# Altium schematic sheet XbeeB.SchDoc
size A4; SheetNumber: 2; SheetTotal: 3
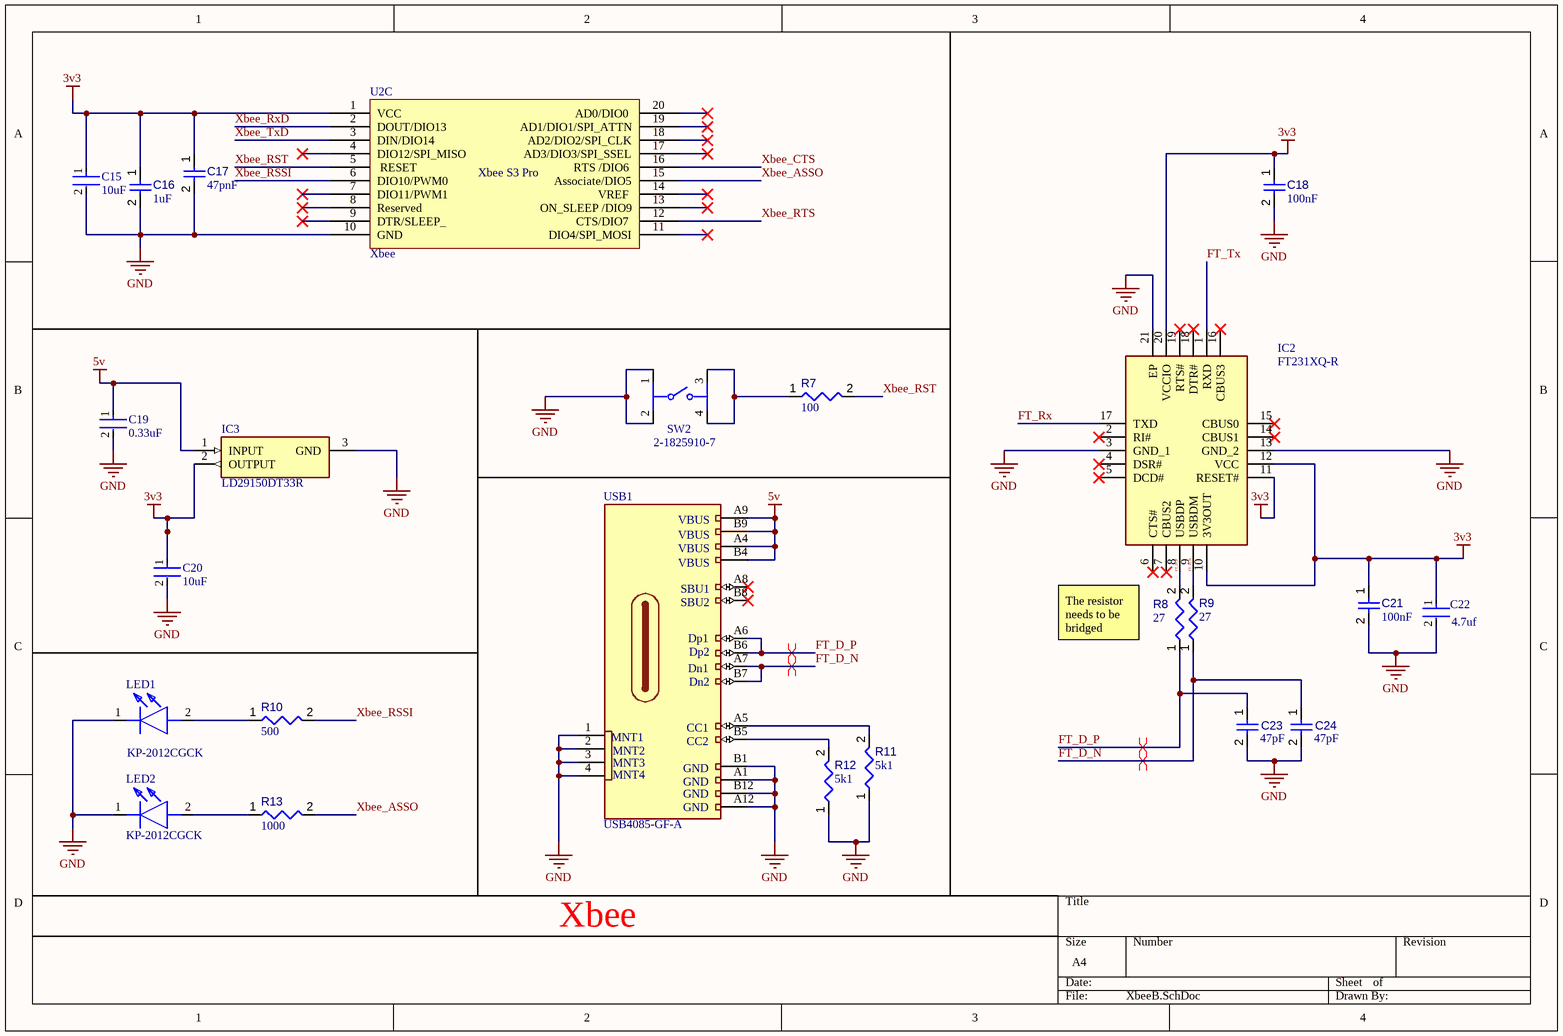
[diagram p0: XbeeB.SchDoc]

## Parts
C15  10uF  [FP-CC1210-GA-MFG]
C16  value 1uF  [CAPC1608X90X40NL10T20]  (hidden comment: Capacitor 100 nF +/-10% 50 V 0603)
C17  value 47pnF  [CAPC1608X90X40NL10T20]  (hidden comment: Capacitor 100 nF +/-10% 50 V 0603)
C18  value 100nF  [CAPC1608X90X40NL10T20]  (hidden comment: Capacitor 100 nF +/-10% 50 V 0603)
C19  0.33uF  [FP-CC1210-GA-MFG]
C20  10uF  [FP-CC1210-GA-MFG]
C21  value 100nF  [CAPC1608X90X40NL10T20]  (hidden comment: Capacitor 100 nF +/-10% 50 V 0603)
C22  4.7uf  [FP-CC0805-0_85-MFG]
C23  value 47pF  [CAPC1608X90X40LL10T20]  (hidden comment: Capacitor 1 uF +/- 10% 25 V 0603)
C24  value 47pF  [CAPC1608X90X40LL10T20]  (hidden comment: Capacitor 1 uF +/- 10% 25 V 0603)
IC2  FT231XQ-R  [QFN50P400X400X80-21N]
IC3  LD29150DT33R  [ST_DPAK_1]
LED1  KP-2012CGCK  [LEDC2012X110N]
LED2  KP-2012CGCK  [LEDC2012X110N]
R7  value 100  [RESC1608X55X25ML10T15]  (hidden comment: Resistor 10k +/-1% 0603 100 mW)
R8  value 27  [RESC1608X55X25ML10T15]  (hidden comment: Resistor 10k +/-1% 0603 100 mW)
R9  value 27  [RESC1608X55X25ML10T15]  (hidden comment: Resistor 10k +/-1% 0603 100 mW)
R10  value 500  [RESC1608X55X25ML10T15]  (hidden comment: Resistor 10k +/-1% 0603 100 mW)
R11  value 5k1  [RESC1608X55X25ML10T15]  (hidden comment: Resistor 10k +/-1% 0603 100 mW)
R12  value 5k1  [RESC1608X55X25ML10T15]  (hidden comment: Resistor 10k +/-1% 0603 100 mW)
R13  value 1000  [RESC1608X55X25ML10T15]  (hidden comment: Resistor 10k +/-1% 0603 100 mW)
SW2  2-1825910-7  [FP-2-1825910-7-MFG]
U2  Xbee  [Xbee]  (part C of 3)
USB1  USB4085-GF-A  [USB4085-GF-A]

## Nets
3v3: C15.1 C16.1 C17.1 C18.1 C20.1 C21.1 C22.1 IC2.10(3V3OUT) IC2.11(RESET#) IC2.12(VCC) IC2.20(VCCIO) IC3.2(OUTPUT) U2.1(VCC)
5v: C19.1 IC3.1(INPUT) USB1.A4(VBUS) USB1.A9(VBUS) USB1.B4(VBUS) USB1.B9(VBUS)
GND: C15.2 C16.2 C17.2 C18.2 C19.2 C20.2 C21.2 C22.2 C23.2 C24.2 IC2.3(GND_1) IC2.13(GND_2) IC2.21(EP) IC3.3(GND) LED1.1(K) LED2.1(K) R11.1 R12.1 SW2.1 SW2.2 U2.10(GND) USB1.1(MNT_1) USB1.2(MNT_2) USB1.3(MNT_3) USB1.4(MNT_4) USB1.A1(GND) USB1.A12(GND) USB1.B1(GND) USB1.B12(GND)
FT_D_N: C24.1 IC2.9(USBDM) R9.1 R9.2 USB1.A7(Dn1) USB1.B7(Dn2)
FT_D_P: C23.1 IC2.8(USBDP) R8.1 R8.2 USB1.A6(Dp1) USB1.B6(Dp2)
FT_Rx: IC2.17(TXD)
FT_Tx: IC2.1(RXD)
Xbee_ASSO: R13.2 U2.15(Associate/DIO5)
Xbee_CTS: U2.16(RTS_/DIO6)
Xbee_RSSI: R10.2 U2.6(DIO10/PWM0)
Xbee_RST: R7.2 U2.5(RESET)
Xbee_RTS: U2.12(CTS/DIO7)
Xbee_RxD: U2.2(DOUT/DIO13)
Xbee_TxD: U2.3(DIN/DIO14)
NetLED1_2: LED1.2(A) R10.1
NetLED2_2: LED2.2(A) R13.1
NetR7_1: R7.1 SW2.3 SW2.4
NetR11_2: R11.2 USB1.A5(CC1)
NetR12_2: R12.2 USB1.B5(CC2)

Not connected (* = marked no-connect by the designer): IC2 2(RI#)* 4(DSR#)* 5(DCD#)* 6(CTS#)* 7(CBUS2)* 14(CBUS1)* 15(CBUS0)* 16(CBUS3)* 18(DTR#)* 19(RTS#)*; U2 4(DIO12/SPI_MISO)* 7(DIO11/PWM1_)* 8(Reserved_)* 9(DTR/SLEEP_)* 11(DIO4/SPI_MOSI)* 13(ON_SLEEP_/DIO9)* 14(VREF_)* 17(AD3/DIO3/SPI_SSEL)* 18(AD2/DIO2/SPI_CLK)* 19(AD1/DIO1/SPI_ATTN)* 20(AD0/DIO0_)*; USB1 A8(SBU1)* B8(SBU2)*

## Layout directives
differential pair: FT_D_N, FT_D_P

## Notes on the sheet
- The resistor needs to be bridged
- Xbee
- (in symbol USB4085-GF-A) MNT1; MNT2; MNT3; MNT4
- (in symbol Xbee, part C) Xbee S3 Pro

## Library data of the parts
C15 C19 C20 = CMP-03422-000918-1: CAP CER 1UF 50V X7R 1210; Manufacturer Part Number: CC1210KKX7R9BB105; Manufacturer: Yageo; Temperature Coefficient: 15%; Material: Ceramic; Tolerance: 10%; RoHS: TRUE; Digikey Description: CAP CER 1UF 50V X7R 1210; Device Class L1: Passive Components; Temperature Range Low: -55°C; Value: 1uF; ComponentLink2Description: Datasheet; Temperature Characteristic: X7R; Capacitance: 1uF; Temperature: -55°C to +125°C; ComponentLink2URL: http://www.yageo.com/documents/recent/UPY-GPHC_X7R_6.3V-to-50V_18.pdf; Lead Free: Yes; Device Class L3: Ceramic Capacitors; Device Class L2: Capacitors; Category: Cap; Temperature Range High: +125°C; Package: CC1210-GA; Mouser Description: 1210 1 uF 50 V ±10 % Tolerance X7R SMT Multilayer Ceramic Capacitor; Octopart: https://octopart.com/cc1210kkx7r9bb105-yageo-22054290; Height: 1.45mm; Voltage Rating: 50V; Ipc Land Pattern Name: CAPC320250X125; Automotive: No; Footprint Url: http://www.yageo.com/exep/pages/download/literatures/UPY-C_GEN_24.pdf
C16-C18 C21 = CMP-001-00017-6: Chip Capacitor, 100 nF, +/- 10%, 50 V, 0603 (1608 Metric); Voltage Rating: 50V; Capacitor Type: Ceramic; Tolerance: 10%; Mounting Technology: SM; Max Operating Temperature: 125°C; RoHS Compliant: True; Pins: 2; Case/Package: 0603; Min Operating Temperature: -55°C
C22 = CMP-2100-03606-3: CAP CER 0.1UF 50V X7R 0805; Manufacturer Part Number: CC0805KRX7R9BB104; Manufacturer: Yageo; Tolerance: 0.1; Capacitance: 100 nF; Value: 100 nF; Material: Ceramic; Device Class L1: Passive Components; ComponentLink2Description: Datasheet; Package: CC0805-0.85; Digikey Description: CAP CER 0.1UF 50V X7R 0805; Device Class L3: Ceramic Capacitors; Temperature: -30°C to +85°C; Temperature Characteristic: X7R; Voltage Rating: 50 V; Height: 0.95mm; RoHS: TRUE; Ipc Land Pattern Name: CAPC200125X85; Device Class L2: Capacitors; Category: Cap; Temperature Range Low: -30°C; Temperature Range High: +85°C; Mouser Description: Multilayer Ceramic Capacitors MLCC - SMD/SMT 100nF 50V X7R 10%; Footprint Url: http://www.yageo.com/exep/pages/download/literatures/UPY-C_GEN_24.pdf; Automotive: No; Octopart: https://octopart.com/cc0805krx7r9bb104-yageo-192993; Lead Free: Yes; ComponentLink2URL: http://www.yageo.com/documents/recent/UPY-GPHC_Y5V_6.3V-to-50V_8.pdf
C23 C24 = CMP-001-00005-6: Chip Capacitor, 1 uF, +/- 10%, 25 V, 0603 (1608 Metric); Capacitor Type: Ceramic; Voltage Rating: 25V; Pins: 2; Mounting Technology: SM; RoHS Compliant: True; Max Operating Temperature: 125°C; Case/Package: 0603; Min Operating Temperature: -55°C; Tolerance: 10%
IC2 = FT231XQ-R: Integrated Circuit; Manufacturer_Name: FTDI Chip; Datasheet Link: http://www.ftdichip.com/Support/Documents/DataSheets/ICs/DS_FT231X.pdf; Height: 0.8mm; Manufacturer_Part_Number: FT231XQ-R; Mouser Part Number: 895-FT231XQ-R; Mouser Price/Stock: https://www.mouser.co.uk/ProductDetail/FTDI/FT231XQ-R?qs=Gp1Yz1mis3VkAf3iW%252BkumQ%3D%3D; Arrow Part Number: FT231XQ-R; Arrow Price/Stock: https://www.arrow.com/en/products/ft231xq-r/ftdi-chip?region=nac
IC3 = LD29150DT33R: Integrated Circuit; Manufacturer_Name: STMicroelectronics; Datasheet Link: http://www.st.com/web/en/resource/technical/document/datasheet/CD00003403.pdf; Manufacturer_Part_Number: LD29150DT33R; Mouser Part Number: 511-LD29150DT33R; Mouser Price/Stock: https://www.mouser.co.uk/ProductDetail/STMicroelectronics/LD29150DT33R?qs=M4RLcaOHglr1iYLz8rxZ4g%3D%3D; Arrow Part Number: LD29150DT33R; Arrow Price/Stock: https://www.arrow.com/en/products/ld29150dt33r/stmicroelectronics?region=nac
LED1 LED2 = KP-2012CGCK: LED; Manufacturer_Name: Kingbright; Datasheet Link: https://componentsearchengine.com/Datasheets/2/KP-2012CGCK.pdf; Height: 1.1mm; Manufacturer_Part_Number: KP-2012CGCK; Mouser Part Number: N/A; Mouser Price/Stock: https://www.mouser.co.uk/ProductDetail/Kingbright/KP-2012CGCK?qs=2JU0tDl2GZ3tjMUbXin2qw%3D%3D; Arrow Part Number: KP-2012CGCK; Arrow Price/Stock: https://www.arrow.com/en/products/kp-2012cgck/kingbright?utm_currency=USD&region=europe
R7-R13 = CMP-009-00017-5: Chip Resistor, 10 KOhm, +/- 1%, 01 W, -55 to 155 degC, 0603 (1608 Metric); Voltage Rating: 50V; Power: 100mW; RoHS Compliant: True; Min Operating Temperature: -55°C; Pins: 2; Case/Package: 0603; Mounting Technology: SM; Max Operating Temperature: 155°C; Tolerance: 1%
SW2 = CMP-03402-000004-1: SWITCH TACTILE SPST-NO 0.05A 24V; Manufacturer: TE Connectivity; Contact Current Rating: 50mA; Operating Force: 160gf; Electromechanical Life: 100000Cycles; Contact Resistance: 100mΩ; ComponentLink2Description: Datasheet; Height: 13.3mm; Digikey Description: SWITCH TACTILE SPST-NO 0.05A 24V; Device Class L2: Switches; Category: Switch; Device Class L3: Pushbutton Switches; Manufacturer Part Number: 2-1825910-7; Device Class L1: Electromechanical; Mount: Through Hole; Temperature Range High: +85°C; ComponentLink2URL: https://www.te.com/commerce/DocumentDelivery/DDEController?Action=showdoc&DocId=Customer+Drawing%7F1825910%7FC10%7Fpdf%7FEnglish%7FENG_CD_1825910_C10.pdf%7F2-1825910-7; RoHS: TRUE; Temperature: -35°C to +85°C; Mouser Description: Switch Tactile OFF (ON) SPST Extended Round Button PC Pins 0.05A 24VDC 100000Cycles 1.57N Thru-Hole Loose; Automotive: No; Voltage Rating Dc: 24V; Package: 2-1825910-7; Lead Free: Yes; Octopart: https://octopart.com/2-1825910-7-te+connectivity-42270510; Temperature Range Low: -35°C; Throw Configuration: SPST-NO